# EAGLE design cc3200-shield-v2.0 (EAGLE 7.5.0)
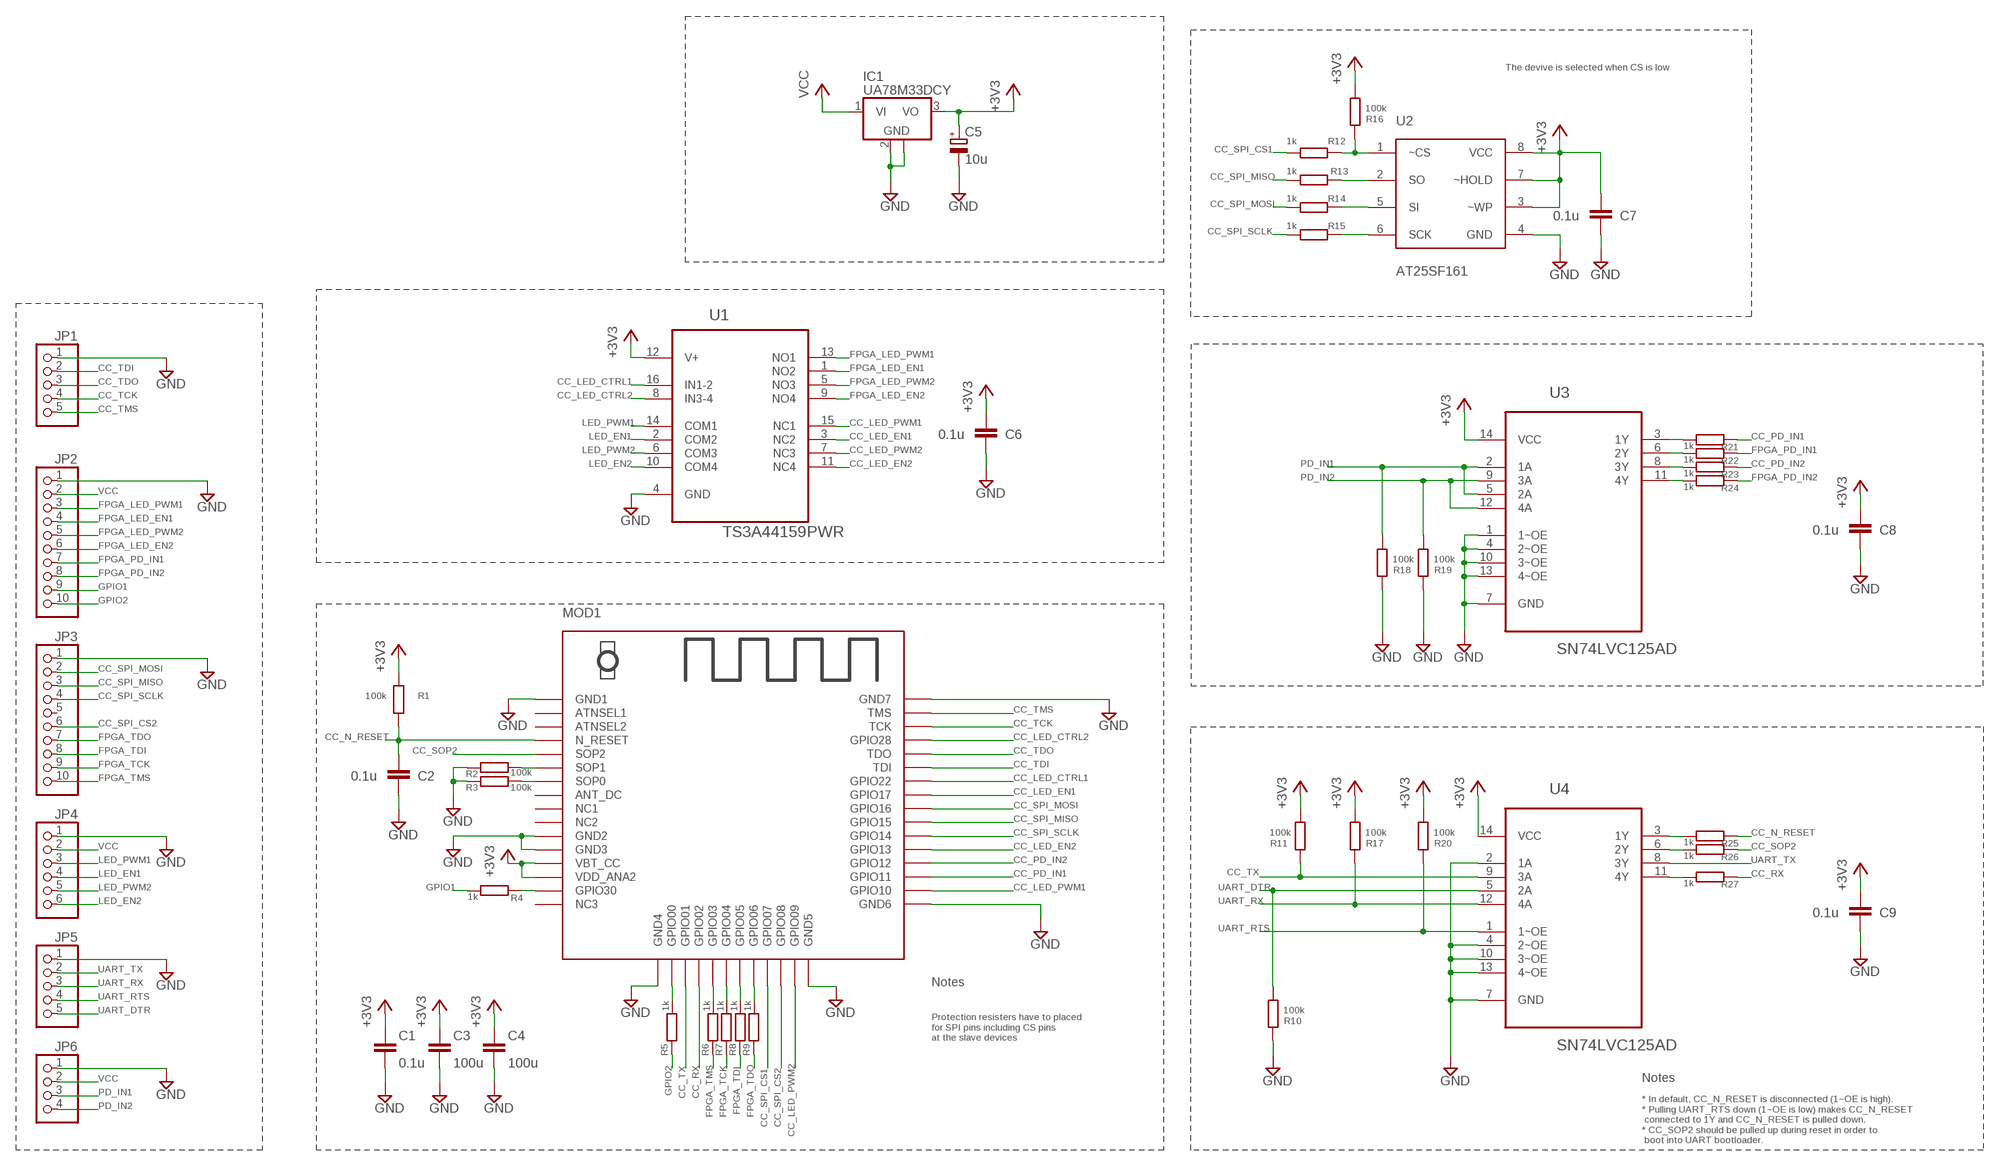
[diagram p0: schematic, sheet 1]

## Parts
C1  0.1u  C-EUC0805  [C0805]
C2  0.1u  C-EUC0805  [C0805]
C3  100u  C-EUC1210  [C1210]
C4  100u  C-EUC1210  [C1210]
C5  10u  CPOL-EU153CLV-0405  [153CLV-0405]
C6  0.1u  C-EUC0805  [C0805]
C7  0.1u  C-EUC0805  [C0805]
C8  0.1u  C-EUC0805  [C0805]
C9  0.1u  C-EUC0805  [C0805]
IC1  UA78M33DCY  [SOT223]
JP1  PINHD-1X51X05-1.27MM  [1X05-1.27MM]
JP2  PINHD-1X10  [1X10]
JP3  PINHD-1X10  [1X10]
JP4  PINHD-1X6  [1X06]
JP5  PINHD-1X51X05-1.27MM  [1X05-1.27MM]
JP6  PINHD-1X41.27MM  [1X04-1.27MM]
MOD1  USR-C322  [USR-C322]
R1  100k  R-EU_R0805  [R0805]
R2  100k  R-EU_R0805  [R0805]
R3  100k  R-EU_R0805  [R0805]
R4  1k  R-EU_R0805  [R0805]
R5  1k  R-EU_R0805  [R0805]
R6  1k  R-EU_R0805  [R0805]
R7  1k  R-EU_R0805  [R0805]
R8  1k  R-EU_R0805  [R0805]
R9  1k  R-EU_R0805  [R0805]
R10  100k  R-EU_R0805  [R0805]
R11  100k  R-EU_R0805  [R0805]
R12  1k  R-EU_R0805  [R0805]
R13  1k  R-EU_R0805  [R0805]
R14  1k  R-EU_R0805  [R0805]
R15  1k  R-EU_R0805  [R0805]
R16  100k  R-EU_R0805  [R0805]
R17  100k  R-EU_R0805  [R0805]
R18  100k  R-EU_R0805  [R0805]
R19  100k  R-EU_R0805  [R0805]
R20  100k  R-EU_R0805  [R0805]
R21  1k  R-EU_R0805  [R0805]
R22  1k  R-EU_R0805  [R0805]
R23  1k  R-EU_R0805  [R0805]
R24  1k  R-EU_R0805  [R0805]
R25  1k  R-EU_R0805  [R0805]
R26  1k  R-EU_R0805  [R0805]
R27  1k  R-EU_R0805  [R0805]
U1  TS3A44159PWR  [SOP65P640X120-16N]
U2  AT25SF161  [SO08]
U3  SN74LVC125AD  [SOIC127P600X175-14N]
U4  SN74LVC125AD  [SOIC127P600X175-14N]

## Nets
+3V3: C1.1 C3.1 C4.1 C5.+ C6.1 C7.1 C8.1 C9.1 IC1.3(VO) MOD1.VBT_CC MOD1.VDD_ANT(VDD_ANA2) R1.2 R11.2 R16.2 R17.2 R20.2 U1.12(V+) U2.3(~WP) U2.7(~HOLD) U2.8(VCC) U3.14(VCC) U4.14(VCC)
CC_LED_CTRL1: MOD1.GPIO22 U1.16(IN1-2)
CC_LED_CTRL2: MOD1.GPIO28 U1.8(IN3-4)
CC_LED_EN1: MOD1.GPIO17 U1.3(NC2)
CC_LED_EN2: MOD1.GPIO13 U1.11(NC4)
CC_LED_PWM1: MOD1.GPIO10 U1.15(NC1)
CC_LED_PWM2: MOD1.GPIO09 U1.7(NC3)
CC_N_RESET: C2.1 MOD1.N_RESET R1.1 R25.1
CC_PD_IN1: MOD1.GPIO11 R21.1
CC_PD_IN2: MOD1.GPIO12 R23.1
CC_RX: MOD1.GPIO02 R27.1
CC_SOP2: MOD1.SOP2 R26.1
CC_SPI_CS1: MOD1.GPIO07 R12.2
CC_SPI_CS2: JP3.6 MOD1.GPIO08
CC_SPI_MISO: JP3.3 MOD1.SPI_MISO/GPIO15(GPIO15) R13.2
CC_SPI_MOSI: JP3.2 MOD1.GPIO16 R14.2
CC_SPI_SCLK: JP3.4 MOD1.GPIO14 R15.2
CC_TCK: JP1.4 MOD1.TCK
CC_TDI: JP1.2 MOD1.TDI
CC_TDO: JP1.3 MOD1.TDO
CC_TMS: JP1.5 MOD1.TMS
CC_TX: MOD1.GPIO01 R11.1 U4.9(3A)
FPGA_LED_EN1: JP2.4 U1.1(NO2)
FPGA_LED_EN2: JP2.6 U1.9(NO4)
FPGA_LED_PWM1: JP2.3 U1.13(NO1)
FPGA_LED_PWM2: JP2.5 U1.5(NO3)
FPGA_PD_IN1: JP2.7 R22.1
FPGA_PD_IN2: JP2.8 R24.1
FPGA_TCK: JP3.9 R7.1
FPGA_TDI: JP3.8 R8.1
FPGA_TDO: JP3.7 R9.1
FPGA_TMS: JP3.10 R6.1
GND: C1.2 C2.2 C3.2 C4.2 C5.- C6.2 C7.2 C8.2 C9.2 IC1.2(GND) IC1.4(GND) JP1.1 JP2.1 JP3.1 JP4.1 JP5.1 JP6.1 MOD1.GND1 MOD1.GND2 MOD1.GND3 MOD1.GND4 MOD1.GND5 MOD1.GND6 MOD1.GND7 R2.1 R3.1 R10.1 R18.1 R19.1 U1.4(GND) U2.4(GND) U3.1(1~OE) U3.4(2~OE) U3.7(GND) U3.10(3~OE) U3.13(4~OE) U4.2(1A) U4.4(2~OE) U4.7(GND) U4.10(3~OE) U4.13(4~OE)
GPIO1: JP2.9 R4.2
GPIO2: JP2.10 R5.1
LED_EN1: JP4.4 U1.2(COM2)
LED_EN2: JP4.6 U1.10(COM4)
LED_PWM1: JP4.3 U1.14(COM1)
LED_PWM2: JP4.5 U1.6(COM3)
N$1: MOD1.SOP1 R2.2
N$2: MOD1.SOP0 R3.2
N$3: MOD1.GPIO00 R5.2
N$6: MOD1.GPIO30 R4.1
N$7: MOD1.GPIO03 R6.2
N$8: MOD1.GPIO04 R7.2
N$9: MOD1.GPIO05 R8.2
N$10: MOD1.GPIO06 R9.2
N$12: R25.2 U4.3(1Y)
N$13: R26.2 U4.6(2Y)
N$14: R27.2 U4.11(4Y)
N$15: R12.1 R16.1 U2.1(~CS)
N$16: R21.2 U3.3(1Y)
N$17: R22.2 U3.6(2Y)
N$18: R23.2 U3.8(3Y)
N$19: R24.2 U3.11(4Y)
N$20: R13.1 U2.2(SO)
N$21: R14.1 U2.5(SI)
N$22: R15.1 U2.6(SCK)
PD_IN1: JP6.3 R18.2 U3.2(1A) U3.5(2A)
PD_IN2: JP6.4 R19.2 U3.9(3A) U3.12(4A)
UART_DTR: JP5.5 R10.2 U4.5(2A)
UART_RTS: JP5.4 R20.1 U4.1(1~OE)
UART_RX: JP5.3 R17.1 U4.12(4A)
UART_TX: JP5.2 U4.8(3Y)
VCC: IC1.1(VI) JP2.2 JP4.2 JP6.2
Unconnected: JP3.5 MOD1.ANT_DC MOD1.ATNSEL1 MOD1.ATNSEL2 MOD1.NC1 MOD1.NC2 MOD1.NC3

## Notes on the sheet
- The devive is selected when CS is low
- Notes
- Protection resisters have to placed 
  for SPI pins including CS pins 
  at the slave devices
- Notes
- * In default, CC_N_RESET is disconnected (1~OE is high).
  * Pulling UART_RTS down (1~OE is low) makes CC_N_RESET 
   connected to 1Y and CC_N_RESET is pulled down.
  * CC_SOP2 should be pulled up during reset in order to 
   boot into UART bootloader.

## Library data of the parts
C1-C4 C6-C9 = resistor:C-EU: CAPACITOR, European symbol
C5 = resistor:CPOL-EU: POLARIZED CAPACITOR, European symbol
IC1 = linear:UA78M*: POSITIVE-VOLTAGE REGULATORS Source: http://focus.ti.com/lit/ds/symlink/ua78m33.pdf
JP1 JP5 = pinhead+:PINHD-1X5: PIN HEADER
JP2 JP3 = pinhead:PINHD-1X10: PIN HEADER
JP4 = pinhead:PINHD-1X6: PIN HEADER
JP6 = pinhead+:PINHD-1X4: PIN HEADER
MOD1 = usr-wifi:USR-C322
R1-R27 = resistor:R-EU_: RESISTOR, European symbol
U1 = misc-parts:TS3A44159PWR: Quad-Channel 2:1 Multiplexer/Demultiplexer; OC_FARNELL: 1755573
U2 = misc-parts:AT25SF161
U3 U4 = misc-parts:SN74LVC125AD: QUADRUPLE BUS BUFFER GATE WITH 3-STATE OUTPUTS; OC_FARNELL: 1102975; PACKAGE: SOIC-14; SUPPLIER: Texas Instruments

## Board
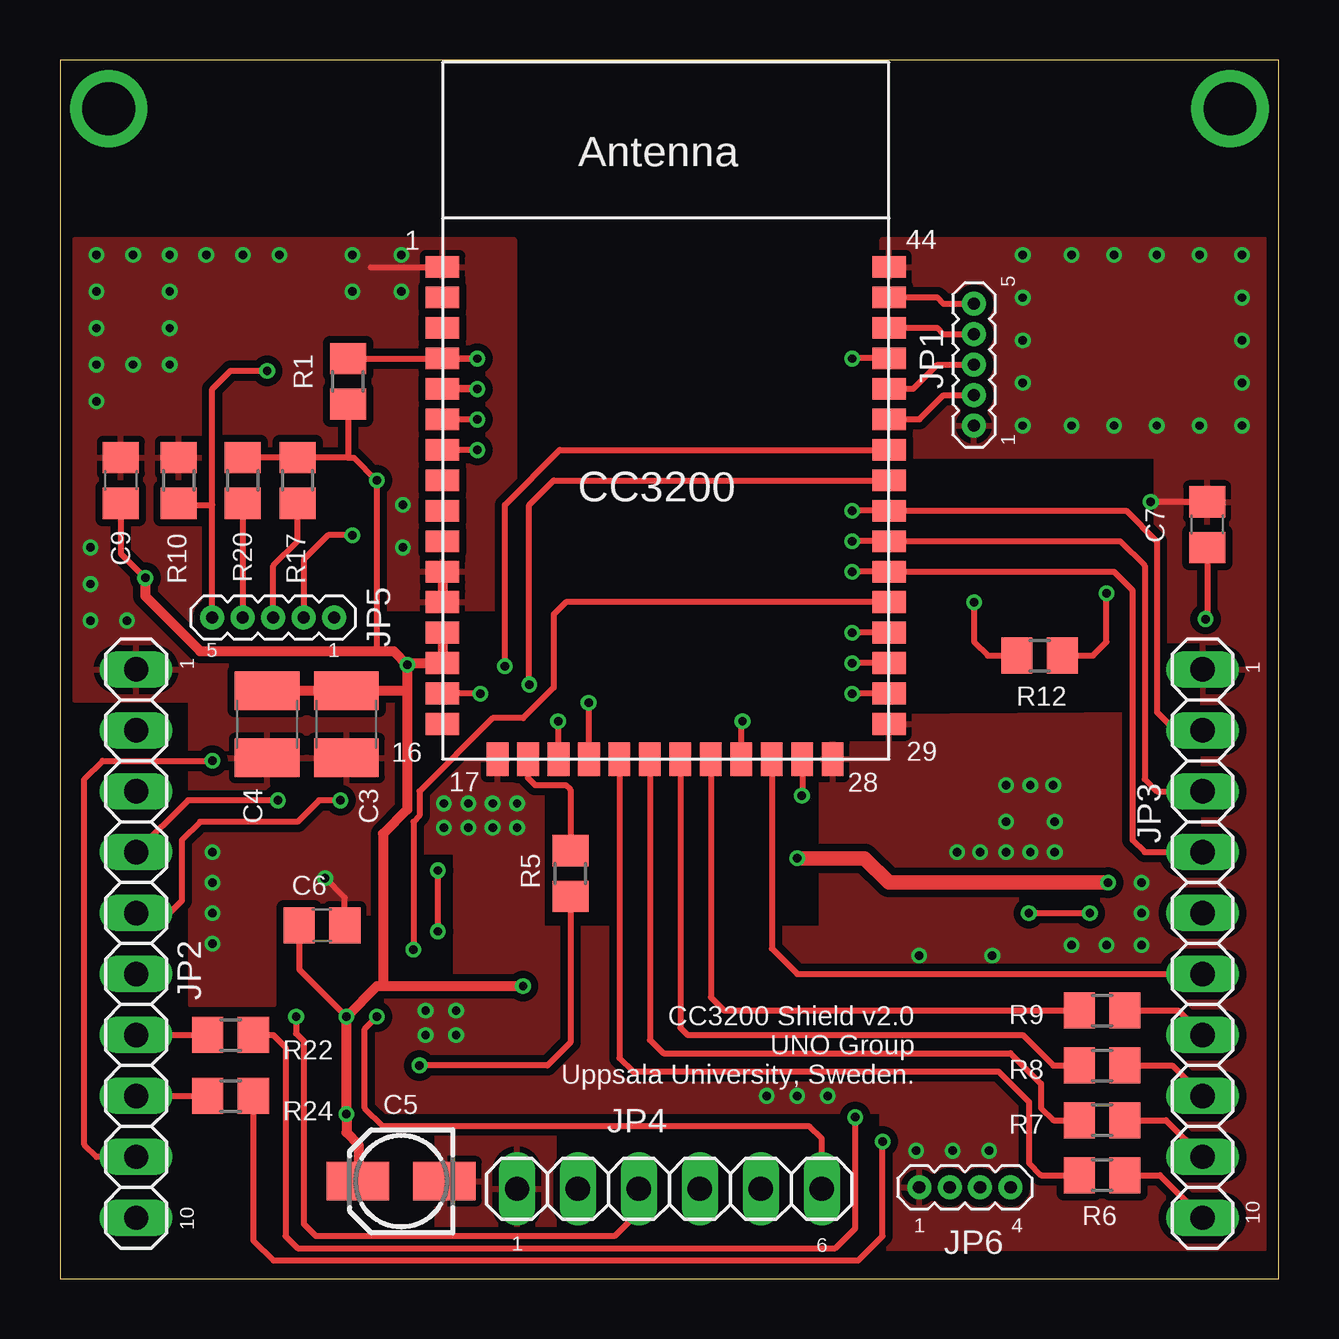
[diagram p1: board, top side]
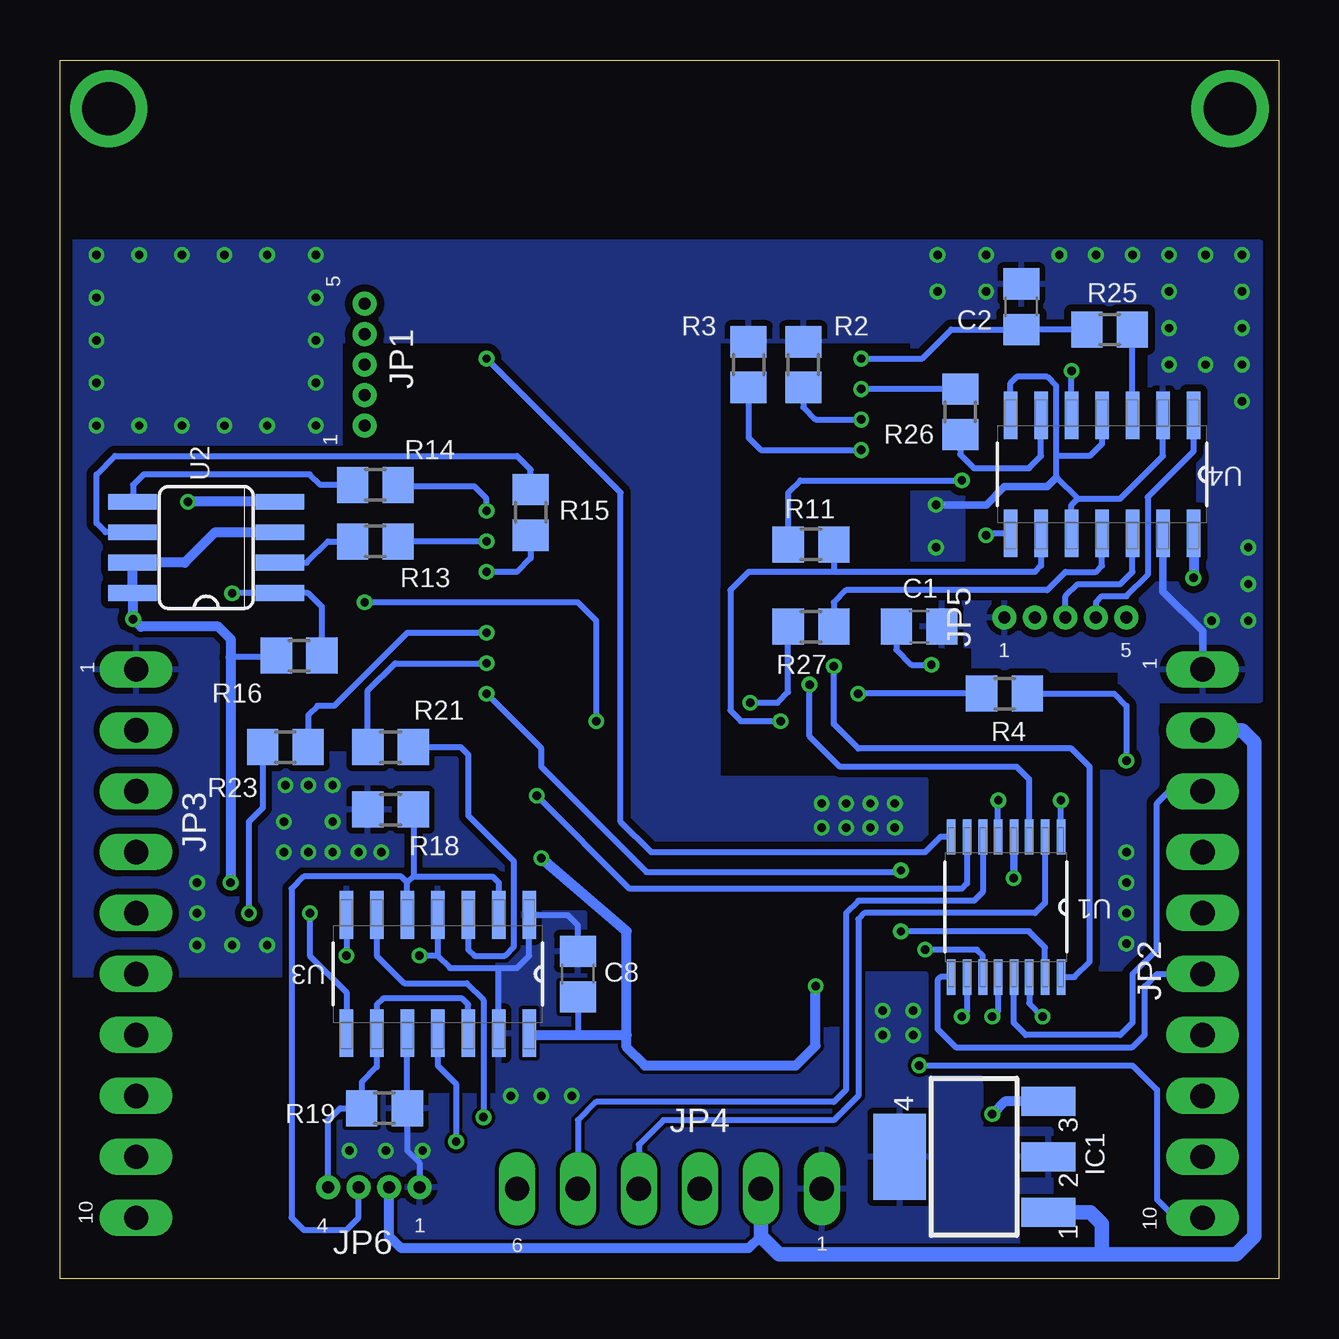
[diagram p2: board, bottom side, seen from below]

Size 50.8 x 50.8 mm. Coordinates in mm from the lower left corner, seen from the top.
Outline: 0,0 50.8,0 50.8,50.8 0,50.8 0,0
Copper layers (1*16): Top 0.035mm / dielectric 1.6mm / Bottom 0.035mm
Design rules "Elecrow-2-layer_PCB_eagle_rule": minimum track width 6mil, minimum drill 12mil, track to track 6mil, track to pad 8mil, pad to pad 12mil, via to via 12mil, smd to smd 0mil, copper to edge 20mil, drill to drill 10mil, minimum pad ring 6mil, minimum via ring 6mil, stop-mask expansion 0mil, vias tented up to drill 100mil, thermal gap 10mil

### Footprints (pad centres in the part's own frame; a part is rotated, then mirrored left to right if it is on the bottom)
C0805 = smd 1.3 x 1.5: 1 -0.95,0; 2 0.95,0
C1210 = smd 1.6 x 2.7: 1 -1.4,0; 2 1.4,0
153CLV-0405 = smd 2.6 x 1.6: + 1.8,0; - -1.8,0
SOT223 = smd 1.219 x 2.235: 1 -2.311,-3.099; 2 0,-3.099; 3 2.311,-3.099 | smd 3.6 x 2.2: 4 0,3.099
1X05-1.27MM = drill 0.508 pad 1: 1 0,0; 2 1.27,0; 3 2.54,0; 4 3.81,0; 5 5.08,0
1X10 = drill 1.016 long: 1 -11.43,0; 2 -8.89,0; 3 -6.35,0; 4 -3.81,0; 5 -1.27,0; 6 1.27,0; 7 3.81,0; 8 6.35,0; 9 8.89,0; 10 11.43,0
1X06 = drill 1.016 long: 1 -6.35,0; 2 -3.81,0; 3 -1.27,0; 4 1.27,0; 5 3.81,0; 6 6.35,0
1X04-1.27MM = drill 0.508 pad 1: 1 0,0; 2 1.27,0; 3 2.54,0; 4 3.81,0
USR-C322 = smd 1.4 x 0.9: ANT_DC -9.46,0.9; ATNSEL1 -9.46,8.52; ATNSEL2 -9.46,7.25; GND1 -9.46,9.79; GND2 -9.46,-2.91; GND3 -9.46,-4.18; GND6 9.16,-9.26; GND7 9.16,9.79; GPIO10 9.16,-7.99; GPIO11 9.16,-6.72; GPIO12 9.16,-5.45; GPIO13 9.16,-4.18; GPIO14 9.16,-2.91; GPIO16 9.16,-0.37; GPIO17 9.16,0.9; GPIO22 9.16,2.17; GPIO28 9.16,5.98; GPIO30 -9.46,-7.99; N_RESET -9.46,5.98; NC1 -9.46,-0.37; NC2 -9.46,-1.64; NC3 -9.46,-9.26; SOP0 -9.46,2.17; SOP1 -9.46,3.44; SOP2 -9.46,4.71; SPI_MISO/GPIO15 9.16,-1.64; TCK 9.16,7.25; TDI 9.16,3.44; TDO 9.16,4.71; TMS 9.16,8.52; VBT_CC -9.46,-5.45; VDD_ANT -9.46,-6.72 | smd 0.9 x 1.4: GND4 -7.16,-10.73; GND5 6.81,-10.73; GPIO00 -5.89,-10.73; GPIO01 -4.62,-10.73; GPIO02 -3.35,-10.73; GPIO03 -2.08,-10.73; GPIO04 -0.81,-10.73; GPIO05 0.46,-10.73; GPIO06 1.73,-10.73; GPIO07 3,-10.73; GPIO08 4.27,-10.73; GPIO09 5.54,-10.73
R0805 = smd 1.3 x 1.5: 1 -0.95,0; 2 0.95,0
SOP65P640X120-16N = smd 1.473 x 0.356: 1 -2.921,2.286; 2 -2.921,1.626; 3 -2.921,0.965; 4 -2.921,0.33; 5 -2.921,-0.33; 6 -2.921,-0.965; 7 -2.921,-1.626; 8 -2.921,-2.286; 9 2.921,-2.286; 10 2.921,-1.626; 11 2.921,-0.965; 12 2.921,-0.33; 13 2.921,0.33; 14 2.921,0.965; 15 2.921,1.626; 16 2.921,2.286
SO08 = smd 0.66 x 2.032: 1 -1.905,-3.073; 2 -0.635,-3.073; 3 0.635,-3.073; 4 1.905,-3.073; 5 1.905,3.073; 6 0.635,3.073; 7 -0.635,3.073; 8 -1.905,3.073
SOIC127P600X175-14N = smd 1.981 x 0.559: 1 -2.464,3.81; 2 -2.464,2.54; 3 -2.464,1.27; 4 -2.464,0; 5 -2.464,-1.27; 6 -2.464,-2.54; 7 -2.464,-3.81; 8 2.464,-3.81; 9 2.464,-2.54; 10 2.464,-1.27; 11 2.464,0; 12 2.464,1.27; 13 2.464,2.54; 14 2.464,3.81

### Placement (x,y rotation side)
C1  14.99,27.18 0 bottom
C2  10.73,40.51 90 bottom
C3  11.94,23.11 270 top
C4  8.64,23.11 270 top
C5  14.22,4.06 180 top
C6  10.92,14.73 0 top
C7  47.82,31.43 90 top
C8  29.21,12.7 90 bottom
C9  2.54,33.27 90 top
IC1  12.7,5.08 90 bottom
JP1  38.1,35.56 90 top
JP2  3.17,13.97 270 top
JP3  47.62,13.97 270 top
JP4  25.4,3.75 0 top
JP5  11.43,27.56 180 top
JP6  35.81,3.81 0 top
MOD1  25.4,32.38 0 top
R1  12,37.4 270 top
R2  19.81,38.1 270 bottom
R3  22.1,38.1 270 bottom
R4  11.43,24.38 0 bottom
R5  21.27,16.89 90 top
R6  43.43,4.32 180 top
R7  43.43,6.6 180 top
R8  43.43,8.89 180 top
R9  43.43,11.18 180 top
R10  4.95,33.27 270 top
R11  19.49,30.61 180 bottom
R12  40.83,25.97 180 top
R13  37.66,30.73 0 bottom
R14  37.66,33.08 0 bottom
R15  31.18,31.94 270 bottom
R16  40.83,25.97 180 bottom
R17  9.91,33.27 90 top
R18  37.02,19.56 0 bottom
R19  37.27,7.11 180 bottom
R20  7.62,33.27 90 top
R21  37.02,22.16 0 bottom
R22  7.11,10.16 0 top
R23  41.4,22.16 180 bottom
R24  7.11,7.62 0 top
R25  7.05,39.56 0 bottom
R26  13.27,36.13 270 bottom
R27  19.49,27.18 0 bottom
U1  11.37,15.49 270 bottom
U2  44.7,30.48 90 bottom
U3  35.05,12.7 270 bottom
U4  7.37,33.53 270 bottom

### Tracks (layer width: path | path; a pad name or v marks a point on that pad's centre or on a via)
+3V3  (via drill 0.35)
  Top 0.254: MOD1.VBT_CC | 12,34.23 R17.2 | R17.2 R20.2 | R1.2 12,34.23 | C9.1 2.54,30.23 v3.56,29.21 | C6.1 9.97,12.89 v11.94,10.92 | C7.1 47.82,27.56 v47.75,27.5 | 13.21,26.16 v13.21,33.27 12.26,34.23 12,34.23
  Top 0.406: MOD1.VBT_CC MOD1.VDD_ANT 14.48,25.66 v14.48,25.59 | R17.2 | v3.56,29.21 3.56,28.45 5.84,26.16 13.21,26.16 13.91,26.16 v14.48,25.59 | C4.1 C3.1 14.48,24.51 | v14.48,25.59 14.48,24.51 | 14.48,24.51 14.48,19.56 13.46,18.54 13.46,12.19 | v19.3,12.19 13.46,12.19 | 13.46,12.19 13.21,12.19 v11.94,10.92 v11.94,6.86 11.94,6.1 12.45,5.59 12.45,4.09 C5.+
  Top 0.61: v43.69,16.51 34.54,16.51 33.53,17.53 v30.73,17.53
  Bottom 0.254: 3.54,31.05 U4.14 | v13.21,33.27 19.94,33.27 20.45,32.77 R11.2 | U1.12 11.7,11.16 v11.94,10.92 | C1.1 15.94,26.22 15.3,25.59 v14.48,25.59 | R16.2 41.78,25.91 | 41.78,25.91 43.69,25.91 | 41.66,25.91 41.78,25.91 | C8.1 29.21,10.16
  Bottom 0.406: 3.54,31.05 3.54,29.23 v3.56,29.21 | v43.69,16.51 43.69,25.91 43.69,26.67 44.2,27.18 47.43,27.18 v47.75,27.5 47.78,27.52 U2.8 U2.7 45.59,29.84 44.32,31.11 U2.3 | v19.3,12.19 19.3,9.72 20.13,8.89 26.42,8.89 27.18,9.65 27.18,10.16 | 27.18,10.16 27.18,14.48 v30.73,17.53 | U3.14 31.24,10.16 29.21,10.16 27.18,10.16 | IC1.3 11.4,7.39 v11.94,6.86
CC_LED_CTRL1  (via drill 0.35)
  Top 0.254: v18.54,25.53 18.54,32.26 20.83,34.54 34.55,34.54 MOD1.GPIO22
  Bottom 0.254: U1.16 8.51,12.57 7.87,13.21 7.87,21.34 8.64,22.1 17.53,22.1 18.54,23.11 v18.54,25.53
CC_LED_CTRL2  (via drill 0.35)
  Top 0.254: MOD1.GPIO28 33.03,38.37 v33.02,38.35
  Bottom 0.254: v33.02,38.35 27.43,32.77 27.43,19.05 26.16,17.78 14.73,17.78 14.1,18.41 U1.8
CC_LED_EN1  (via drill 0.35)
  Top 0.254: 34.29,33.02 MOD1.GPIO17 34.55,33.27 20.57,33.27 19.56,32.26 v19.56,24.77
  Bottom 0.254: U1.3 10.4,20.82 10.92,21.34 18.29,21.34 19.56,22.61 v19.56,24.77
CC_LED_EN2  (via drill 0.35)
  Top 0.254: MOD1.GPIO13 21.09,28.2 20.57,27.69 20.57,24.64 19.3,23.37 18.03,23.37 14.99,20.32 14.99,19.3 14.73,19.05 v14.73,13.72
  Bottom 0.254: U1.11 12.33,13.47 12.57,13.72 v14.73,13.72
CC_LED_PWM1  (via drill 0.35)
  Top 0.254: MOD1.GPIO10 33.03,24.39 v33.02,24.38 | v15.75,17.02 v15.75,14.48
  Bottom 0.254: U1.15 9.74,13.8 10.41,14.48 v15.75,14.48 | v33.02,24.38 30.73,22.1 30.73,21.34 26.35,16.95 15.81,16.95 v15.75,17.02
CC_LED_PWM2  (via drill 0.35)
  Top 0.254: MOD1.GPIO09 30.94,20.14 v30.92,20.13
  Bottom 0.254: U1.7 12.99,16.47 13.21,16.26 27.05,16.26 v30.92,20.13
CC_N_RESET  (via drill 0.35)
  Top 0.254: MOD1.N_RESET 15.95,38.35 v17.4,38.35 R1.1
  Bottom 0.254: v17.4,38.36 v17.4,38.35 14.86,38.35 13.65,39.56 C2.1 R25.1
CC_PD_IN1  (via drill 0.35)
  Top 0.254: MOD1.GPIO11 33.03,25.66 v33.02,25.65
  Bottom 0.254: R21.1 37.97,24.51 36.83,25.65 v33.02,25.65
CC_PD_IN2  (via drill 0.35)
  Top 0.254: MOD1.GPIO12 33.03,26.93 v33.02,26.92
  Bottom 0.254: v33.02,26.92 36.32,26.92 39.37,23.88 40.07,23.88 40.45,23.5 R23.1
CC_RX  (via drill 0.35)
  Top 0.254: MOD1.GPIO02 22.05,23.99 v22.04,24
  Bottom 0.254: R27.1 20.45,24.45 20.89,24 v22.04,24
CC_SOP2  (via drill 0.35)
  Top 0.305: MOD1.SOP2 17.39,37.09 v17.4,37.08
  Bottom 0.254: R26.1 v17.4,37.08
  Bottom 0.305: 17.39,37.09 v17.4,37.08
CC_SPI_CS1  (via drill 0.35)
  Top 0.254: v38.1,28.19 38.1,26.54 38.67,25.97 R12.2 | MOD1.GPIO07 28.4,23.19 v28.45,23.24
  Bottom 0.254: v38.1,28.19 29.21,28.19 28.45,27.43 v28.45,23.24
CC_SPI_CS2
  Top 0.254: MOD1.GPIO08 29.67,13.76 30.73,12.7 JP3.6
CC_SPI_MISO  (via drill 0.35)
  Top 0.254: JP3.3 45.72,20.32 45.21,20.83 45.21,29.72 44.19,30.75 MOD1.SPI_MISO/GPIO15 33.03,30.75 v33.02,30.73
  Bottom 0.254: v33.02,30.73 R13.2
CC_SPI_MOSI  (via drill 0.35)
  Top 0.254: JP3.2 46.48,22.86 45.72,23.62 45.72,30.73 44.44,32.02 MOD1.GPIO16 33.03,32.02 v33.02,32
  Bottom 0.254: v33.02,32 33.02,32.51 33.53,33.02 36.64,33.02 R14.2
CC_SPI_SCLK  (via drill 0.35)
  Top 0.254: JP3.4 45.21,17.78 44.7,18.29 44.7,28.7 43.93,29.48 MOD1.GPIO14 33.03,29.48 v33.02,29.46
  Bottom 0.254: R15.2 31.18,30.04 31.75,29.46 v33.02,29.46
CC_TCK
  Top 0.254: MOD1.TCK 36.56,39.63 36.83,39.37 JP1.4
CC_TDI
  Top 0.254: MOD1.TDI 35.83,35.83 36.83,36.83 JP1.2
CC_TDO
  Top 0.254: MOD1.TDO 35.57,37.09 36.58,38.1 JP1.3
CC_TMS
  Top 0.254: MOD1.TMS 36.56,40.91 36.83,40.64 JP1.5
CC_TX  (via drill 0.35)
  Top 0.254: MOD1.GPIO01 20.78,23.23 v20.77,23.24
  Bottom 0.254: U4.9 9.91,29.72 10.16,29.46 18.54,29.46 | R11.1 18.54,29.46 | 18.54,29.46 22.1,29.46 22.86,28.7 22.86,23.69 22.42,23.24 v20.77,23.24
FPGA_LED_EN1  (via drill 0.35)
  Top 0.254: v9.08,19.94 5.33,19.94 JP2.4
  Bottom 0.254: U1.1 v9.08,19.94
FPGA_LED_EN2
  Bottom 0.254: U1.9 14.1,12.57 14.22,12.45 14.22,10.41 13.46,9.65 6.1,9.65 5.59,10.16 5.59,12.19 5.08,12.7 JP2.6
FPGA_LED_PWM1
  Bottom 0.254: U1.13 11.05,10.67 10.54,10.16 6.6,10.16 6.1,10.67 6.1,12.7 5.08,13.72 5.08,19.81 4.57,20.32 JP2.3
FPGA_LED_PWM2  (via drill 0.35)
  Top 0.254: v11.68,19.94 10.79,19.94 9.91,19.05 5.84,19.05 5.08,18.29 5.08,15.75 4.57,15.24 JP2.5
  Bottom 0.254: U1.5 11.7,19.93 v11.68,19.94
FPGA_PD_IN1
  Top 0.254: JP2.7 R22.1
FPGA_PD_IN2
  Top 0.254: JP2.8 R24.1
FPGA_TCK
  Top 0.254: R7.1 46.1,6.6 JP3.9
FPGA_TDI
  Top 0.254: R8.1 46.35,8.89 JP3.8
FPGA_TDO
  Top 0.254: R9.1 46.61,11.18 JP3.7
FPGA_TMS
  Top 0.254: R6.1 45.85,4.32 JP3.10
GND  (via drill 0.35)
  Top 0.254: 12.95,42.16 MOD1.GND1 | C6.2 11.87,15.88 v11.05,16.7 | C7.2 v45.47,32.38
  Top 0.406: MOD1.GND2 MOD1.GND3
  Bottom 0.254: U4.10 8.64,32.26 8.38,32.51 | 8.38,32.51 6.6,32.51 4.83,34.29 U4.2 | U3.10 R19.1 36.33,5.34 35.81,4.83 JP6.1 | U3.4 35.05,13.46 | 35.05,13.46 34.54,12.95 32.51,12.95 | 32.51,12.95 31.75,12.95 31.24,13.46 U3.1 29.64,15.16 29.21,14.73 C8.2 29.21,13.72 | U3.13 32.51,12.95 | U4.7 11.18,37.34 10.92,37.59 9.65,37.59 9.27,37.21 9.27,34.29 | 8.38,32.51 9.27,33.4 9.27,34.29 | U4.4 7.37,34.8 7.87,34.29 9.27,34.29 | U3.7 v38.86,13.46 | 35.05,13.46 v35.81,13.46
  Bottom 0.305: U1.4 11.04,16.71 v11.05,16.7 | v14.29,32.26 12.19,32.26 11.43,33.02 9.65,33.02 9.27,33.4 | U4.13 4.83,28.64 3.17,26.99 JP2.1
  Bottom 0.406: U2.4 v45.47,32.38
  other vias: 39.43,20.57 41.4,20.57 14.29,30.48 6.1,42.67 7.62,42.67 9.14,42.67 1.27,28.96 1.27,30.48 1.52,42.67 4.57,42.67 3.05,42.67 4.57,41.15 1.52,38.1 4.57,39.62 1.52,41.15 1.52,39.62 4.57,38.1 1.52,36.58 1.27,27.43 2.79,27.43 3.05,38.1 35.69,5.33 37.21,5.33 38.73,5.33 29.46,7.62 30.73,7.62 32,7.62 6.35,17.78 6.35,16.51 6.35,15.24 6.35,13.97 16,19.81 17.02,19.81 18.03,19.81 19.05,19.81 16,18.8 17.02,18.8 18.03,18.8 19.05,18.8 40.13,42.67 42.16,42.67 43.94,42.67 45.72,42.67 47.5,42.67 49.28,42.67 40.13,40.89 49.28,40.89 40.13,39.12 49.28,39.12 40.13,37.34 49.28,37.34 40.13,35.56 42.16,35.56 43.94,35.56 45.72,35.56 47.5,35.56 49.28,35.56 15.24,11.18 16.51,11.18 16.51,10.16 15.24,10.16 12.19,42.67 14.22,41.15 14.22,42.67 12.19,41.15 39.43,19.05 39.43,17.78 41.47,19.05 41.47,17.78 40.45,20.57 40.45,17.78 38.35,17.78 37.4,17.78 42.16,13.91 43.62,13.91 45.09,13.91 45.09,15.24 45.09,16.51
  pour Top (isolate 0.305): 34.29,43.31 50.23,43.31 50.23,1.27 34.29,1.27 34.29,6.99 13.08,6.99 13.08,12.06 16.51,12.06 16.51,17.78 14.99,17.78 14.99,21.59 20.07,21.59 20.07,14.61 31.75,14.61 31.75,22.29 34.29,22.29 34.29,23.43 42.74,23.5 44.45,23.5 44.45,17.78 47.69,17.84 47.62,26.61 45.72,26.61 45.72,34.29 34.29,34.29
  pour Top (isolate 0.305): 0.64,43.31 18.92,43.31 18.92,27.94 12.7,27.94 12.7,30.48 10.16,30.48 10.16,25.4 13.97,25.4 13.97,15.24 8.89,15.24 8.89,11.43 5.46,11.43 5.46,24.13 0.64,24.13
  pour Bottom (isolate 0.305): 0.76,43.18 50.29,43.18 50.29,26.67 44.2,26.67 44.2,27.94 48.26,27.94 48.26,34.04 39.12,34.04 39.12,39.12 33.02,39.12 29.97,35.81 29.97,17.78 14.73,17.78 14.73,20.83 23.37,20.83 23.37,39.12 15.24,39.12 15.24,26.42 12.7,26.42 12.7,25.4 6.6,25.4 6.6,21.08 7.62,21.08 7.62,12.95 5.08,12.95 5.08,24.13 0.76,24.13
  pour Bottom (isolate 0.254): 31.5,21.84 44.2,21.84 44.2,26.92 50.29,26.92 50.29,12.7 41.15,12.7 41.15,15.75 31.5,15.75
  pour Bottom: 39.12,1.27 39.12,7.62 32.51,7.62 32.51,15.24 28.96,15.24 28.96,10.16 17.78,10.41 17.27,10.41 17.27,12.7 14.73,12.7 14.73,8.38 12.45,8.38 12.45,6.22 9.53,6.22 9.53,3.56 10.92,3.56 10.92,1.27
  pour Top (isolate 0.254): 15.75,6.1 20.57,6.1 20.57,1.78 15.75,1.78
GPIO1  (via drill 0.35)
  Top 0.254: JP2.9 1.52,5.08 1.02,5.59 1.02,20.83 1.78,21.59 v6.35,21.59
  Bottom 0.254: R4.2 6.86,24.38 6.35,23.88 v6.35,21.59
GPIO2  (via drill 0.35)
  Top 0.254: R5.1 21.27,9.84 20.32,8.89 v14.99,8.89
  Bottom 0.254: v14.99,8.89 6.1,8.89 5.08,7.87 5.08,3.3 4.32,2.54 JP2.10
LED_EN1
  Bottom 0.254: U1.2 9.74,15.66 10.16,15.24 17.27,15.24 17.53,14.99 17.53,7.62 18.54,6.6 25.65,6.6 26.67,5.59 JP4.4
LED_EN2  (via drill 0.35)
  Top 0.254: v13.21,10.92 12.7,10.41 12.7,7.11 13.46,6.35 31.24,6.35 31.75,5.84 JP4.6
  Bottom 0.254: U1.10 12.99,11.14 v13.21,10.92
LED_PWM1  (via drill 0.35)
  Top 0.254: JP4.3 24.13,2.79 23.11,1.78 10.67,1.78 10.16,2.29 10.16,9.91 9.84,10.22 v9.84,10.92
  Bottom 0.254: U1.14 10.4,11.48 v9.84,10.92
LED_PWM2
  Bottom 0.254: U1.6 12.33,16.12 12.7,15.75 17.53,15.75 18.03,15.24 18.03,7.87 18.54,7.37 28.45,7.37 29.21,6.6 JP4.5
N$1  (via drill 0.35)
  Top 0.254: MOD1.SOP1 17.39,35.83 v17.4,35.81
  Bottom 0.254: R2.2 19.81,36.32 19.3,35.81 v17.4,35.81
N$2  (via drill 0.35)
  Top 0.254: MOD1.SOP0 17.39,34.55 v17.4,34.54
  Bottom 0.254: R3.2 22.1,35.05 21.59,34.54 v17.4,34.54
N$3
  Top 0.254: 19.49,21.66 MOD1.GPIO00 19.51,20.88 19.81,20.57 21.08,20.57 21.27,20.38 R5.2
N$4
  cutout Bottom (isolate 0.305): 5.59,38.35 12.95,38.35 12.95,29.21 3.56,29.21 3.56,36.58 5.59,36.58
N$6  (via drill 0.35)
  Top 0.254: v17.53,24.38 15.95,24.38 MOD1.GPIO30
  Bottom 0.254: R4.1 v17.53,24.38
N$7
  Top 0.254: MOD1.GPIO03 23.32,9.19 23.88,8.64 39.12,8.64 40.39,7.37 40.39,4.83 40.89,4.32 R6.2
N$8
  Top 0.254: MOD1.GPIO04 24.59,9.95 25.15,9.4 39.62,9.4 40.89,8.13 40.89,7.11 41.4,6.6 R7.2
N$9
  Top 0.254: MOD1.GPIO05 25.86,10.46 26.16,10.16 40.13,10.16 41.4,8.89 R8.2
N$10
  Top 0.254: MOD1.GPIO06 27.13,11.73 27.69,11.18 R9.2
N$12
  Bottom 0.254: U4.3 R25.2
N$13
  Bottom 0.254: R26.2 13.27,34.35 12.7,33.78 10.41,33.78 9.91,34.29 U4.6
N$14
  Bottom 0.254: U4.11 7.37,29.72 7.62,29.46 8.89,29.46 9.65,28.7 18.03,28.7 18.54,28.19 R27.2
N$15  (via drill 0.35)
  Top 0.254: R12.1 43.05,25.97 43.62,26.54 v43.62,28.57
  Bottom 0.254: v43.62,28.57 42.16,28.57 U2.1 40.45,28.57 39.88,28.01 R16.1 39.88,25.72
N$16
  Bottom 0.254: U3.3 33.78,13.72 33.53,13.46 32.26,13.46 31.88,13.84 31.88,17.4 33.78,19.3 33.78,21.84 34.1,22.16 R21.2
N$17  (via drill 0.35)
  Top 0.254: v33.15,6.73 33.15,2.1 32.32,1.27 9.91,1.27 9.4,1.78 9.4,9.65 8.89,10.16 R22.2
  Bottom 0.254: U3.6 37.59,13.46 36.45,12.32 33.85,12.32 33.15,11.62 v33.15,6.73
N$18  (via drill 0.35)
  Top 0.254: v40.39,15.24 v42.93,15.24
  Bottom 0.254: R23.2 42.35,19.62 42.93,19.05 v42.93,15.24 | v40.39,15.24 40.39,13.46 38.86,11.94 U3.8
N$19  (via drill 0.35)
  Top 0.254: v34.29,5.71 34.29,1.78 33.27,0.76 8.89,0.76 8.06,1.59 R24.2
  Bottom 0.254: U3.11 35.05,8.89 34.29,8.13 v34.29,5.71
N$20
  Bottom 0.254: U2.2 40.51,29.84 39.62,30.73 R13.1
N$21
  Bottom 0.254: R14.1 39.94,33.08 40.39,33.53 47.31,33.53 47.75,33.08 47.75,32.41 U2.5
N$22
  Bottom 0.254: U2.6 48.9,31.11 49.28,31.5 49.28,33.53 48.51,34.29 31.75,34.29 31.18,33.72 R15.1
N$200  (via drill 2.2)
  other vias: 2.03,48.77
N$201  (via drill 2.2)
  other vias: 48.77,48.77
PD_IN1
  Bottom 0.254: U3.5 36.32,16.51 | 36.32,16.51 36.07,16.76 | 36.07,16.76 32.77,16.76 32.51,16.51 U3.2 | 36.32,16.51 36.58,16.76 40.64,16.76 41.15,16.26 41.15,2.54 40.64,2.03 38.86,2.03 38.35,2.54 JP6.3 | R18.2 36.07,16.77 36.07,16.76
PD_IN2
  Bottom 0.254: U3.12 33.78,11.43 34.04,11.68 37.34,11.68 37.59,11.43 U3.9 37.59,8.83 38.23,8.19 R19.2 39.12,7.11 39.62,6.6 JP6.4
UART_DTR  (via drill 0.35)
  Top 0.254: JP5.5 6.35,32.26 | 6.35,32.26 6.35,37.08 7.11,37.85 v8.64,37.85 | R10.2 4.95,32.26 6.35,32.26
  Bottom 0.254: U4.5 v8.64,37.85
UART_RTS
  Top 0.254: R20.1 JP5.4
  Bottom 0.254: JP5.4 7.62,28.19 7.37,28.45 6.35,28.45 5.46,29.34 5.46,32.58 3.56,34.48 U4.1
UART_RX
  Top 0.254: JP5.3 8.89,29.72 9.91,30.73 R17.1
  Bottom 0.254: JP5.3 8.89,28.45 8.38,28.96 6.6,28.96 6.1,29.46 U4.12
UART_TX  (via drill 0.35)
  Top 0.254: v12.19,30.99 11.18,30.99 10.16,29.97 JP5.2
  Bottom 0.254: U4.8 12.12,31.06 v12.19,30.99
VCC
  Bottom 0.406: 21.59,1.78 22.1,1.27 36.58,1.27 37.08,1.78 JP6.2
  Bottom 0.61: 21.59,4.32 JP4.2 21.59,1.78 20.83,1.02 7.37,1.02 | JP2.2 1.52,22.86 1.02,22.35 1.02,1.78 1.78,1.02 7.37,1.02 | IC1.1 7.85,2.77 7.37,2.29 7.37,1.02

### Text on the board
tNames: 5 | 1 | 5 | 1 | 1 | 1 | CC3200 Shield v2.0 / UNO Group / Uppsala University, Sweden. | 1 | 4 | 10 | 10 | 1 | 6
bNames: 5 | JP1 | 1 | JP5 | 5 | 1 | 1 | 1 | JP3 | JP2 | JP4 | 1 | 4 | 10 | 10 | 1 | 6 | JP6